# EAGLE schematic Battery Charger (EAGLE 7.5.0)
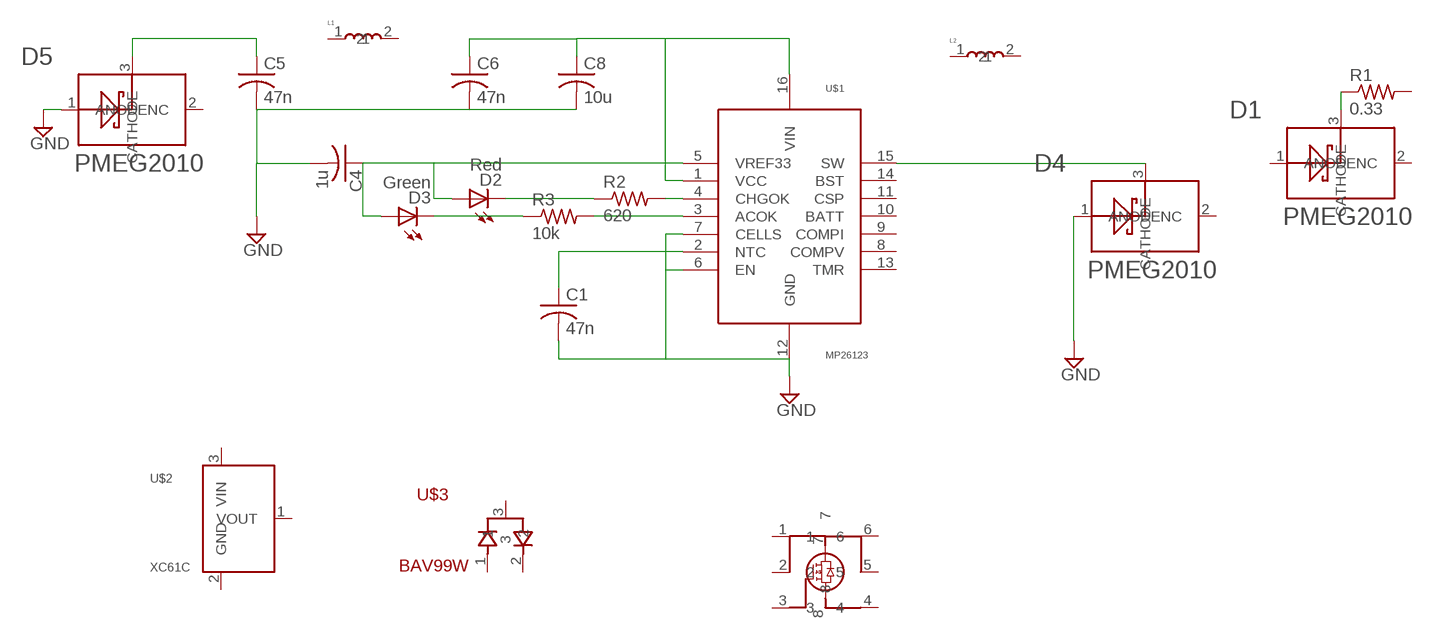
[diagram p0: schematic, sheet 1]

## Parts
C1  47n  C-USC0805  [C0805]
C4  1u  C-USC0805  [C0805]
C5  47n  C-USC0805  [C0805]
C6  47n  C-USC0805  [C0805]
C8  10u  C-USC0805  [C0805]
D1  DIODE-PMEG2010  [DIODE-SOT23]
D2  Red  LED3MM  [LED3MM]
D3  Green  LED3MM  [LED3MM]
D4  DIODE-PMEG2010  [DIODE-SOT23]
D5  DIODE-PMEG2010  [DIODE-SOT23]
L1  L-SMD-2  [SMD-2]
L2  L-SMD-2  [SMD-2]
Q1  MOSFET-IRFHS8242  [PQFN2X2]
R1  0.33  R-US_R2512  [R2512]
R2  620  R-US_R0805  [R0805]
R3  10k  R-US_R0805  [R0805]
U$1  IC-MP26123  [QFN16-4MM]
U$2  IC-XC61C  [SOT23]
U$3  DIODE-BAV99W  [SOT323]

## Nets
GND: C1.2 C4.2 C5.2 C6.2 C8.2 D4.1(ANODE) D5.1(ANODE) U$1.6(EN) U$1.7(CELLS) U$1.12(GND)
N$1: R2.2 U$1.4(CHGOK)
N$2: R3.2 U$1.3(ACOK)
N$3: C4.1 D2.A D3.A U$1.5(VREF33)
N$4: C6.1 C8.1 U$1.1(VCC) U$1.16(VIN)
N$5: C5.1 D5.3(CATHODE)
N$6: D2.K(C) R2.1
N$7: D3.K(C) R3.1
N$8: C1.1 U$1.2(NTC)
N$9: D4.3(CATHODE) U$1.15(SW)
N$10: D1.3(CATHODE) R1.1
Unconnected: D1.1(ANODE) D1.2(NC) D4.2(NC) D5.2(NC) L1.1 L1.2 L2.1 L2.2 Q1.3 R1.2 U$1.8(COMPV) U$1.9(COMPI) U$1.10(BATT) U$1.11(CSP) U$1.13(TMR) U$1.14(BST) U$2.1(VOUT) U$2.2(GND) U$2.3(VIN) U$3.1 U$3.2 U$3.3

## Power pins joined to a net without a drawn wire
1: Q1.1
2: Q1.2
4: Q1.4
5: Q1.5
6: Q1.6
7: Q1.7
8: Q1.8

## Library data of the parts
C1 C4-C6 C8 = resistor:C-US: CAPACITOR, American symbol
D1 D4 D5 = Raj:DIODE-PMEG2010: Schottky Diode
D2 D3 = led:LED: LED OSRAM: - CHIPLED LG R971, LG N971, LY N971, LG Q971, LY Q971, LO R971, LY R971 LH N974, LH R974 LS Q976, LO Q976, LY Q976 LO Q996 - Hyper CHIPLED LW Q18S LB Q993, LB Q99A, LB R99A - SideLED LS A670, LO A670, LY A670, LG A670, LP A670 LB A673, LV A673, LT A673, LW A673 LH A674 LY A675 LS A676, LA A676, LO A676, LY A676, LW A676 LS A679, LY A679, LG A679 - Hyper Micro SIDELED® LS Y876, LA Y876, LO Y876, LY Y876 LT Y87S - SmartLED LW L88C, LW L88S LB L89C, LB L89S, LG L890 LS L89K, LO L89K, LY L89K LS L896, LA L896, LO L896, LY L896 - TOPLED LS T670, LO T670, LY T670, LG T670, LP T670 LSG T670, LSP T670, LSY T670, LOP T670, LYG T670 LG T671, LOG T671, LSG T671 LB T673, LV T673, LT T673, LW T673 LH T674 LS T676, LA T676, LO T676, LY T676, LB T676, LH T676, LSB T676, LW T676 LB T67C, LV T67C, LT T67C, LS T67K, LO T67K, LY T67K, LW E67C LS E67B, LA E67B, LO E67B, LY E67B, LB E67C, LV E67C, LT E67C LW T67C LS T679, LY T679, LG T679 LS T770, LO T770, LY T770, LG T770, LP T770 LB T773, LV T773, LT T773, LW T773 LH T774 LS E675, LA E675, LY E675, LS T675 LS T776, LA T776, LO T776, LY T776, LB T776 LHGB T686 LT T68C, LB T68C - Hyper Mini TOPLED® LB M676 - Mini TOPLED Santana® LG M470 LS M47K, LO M47K, LY M47K Source: http://www.osram.convergy.de LUXEON: - LUMILED® LXK2-PW12-R00, LXK2-PW12-S00, LXK2-PW14-U00, LXK2-PW14-V00 LXK2-PM12-R00, LXK2-PM12-S00, LXK2-PM14-U00 LXK2-PE12-Q00, LXK2-PE12-R00, LXK2-PE12-S00, LXK2-PE14-T00, LXK2-PE14-U00 LXK2-PB12-K00, LXK2-PB12-L00, LXK2-PB12-M00, LXK2-PB14-N00, LXK2-PB14-P00, LXK2-PB14-Q00 LXK2-PR12-L00, LXK2-PR12-M00, LXK2-PR14-Q00, LXK2-PR14-R00 LXK2-PD12-Q00, LXK2-PD12-R00, LXK2-PD12-S00 LXK2-PH12-R00, LXK2-PH12-S00 LXK2-PL12-P00, LXK2-PL12-Q00, LXK2-PL12-R00 Source: www.luxeon.com KINGBRIGHT: KA-3528ASYC Source: www.kingbright.com
L1 L2 = Raj:L-SMD-2
Q1 = Raj:MOSFET-IRFHS8242
R1-R3 = resistor:R-US_: RESISTOR, American symbol
U$1 = Raj:IC-MP26123: Li Ion Battery Charger
U$2 = Raj:IC-XC61C: Voltage Detector
U$3 = Raj:DIODE-BAV99W: Dual Switching Diode